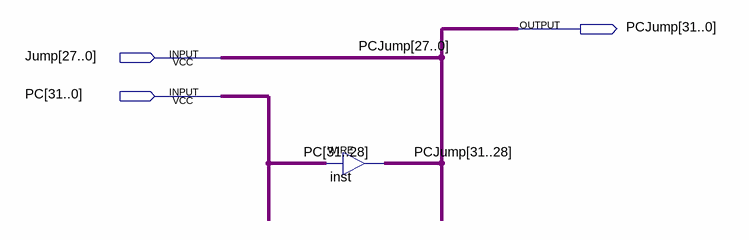
[diagram p0: schematic sheet]
// Quartus schematic join.bdf as structural Verilog: 1 symbols, 3 pins
module \join  (
  input  [27:0] Jump,
  input  [31:0] PC,
  output [31:0] PCJump
);

  assign PCJump[31:28] = PC[31:28];  // WIRE inst

  assign PCJump[27:0] = Jump;
endmodule
